# EAGLE design mainboard (EAGLE 5.10)
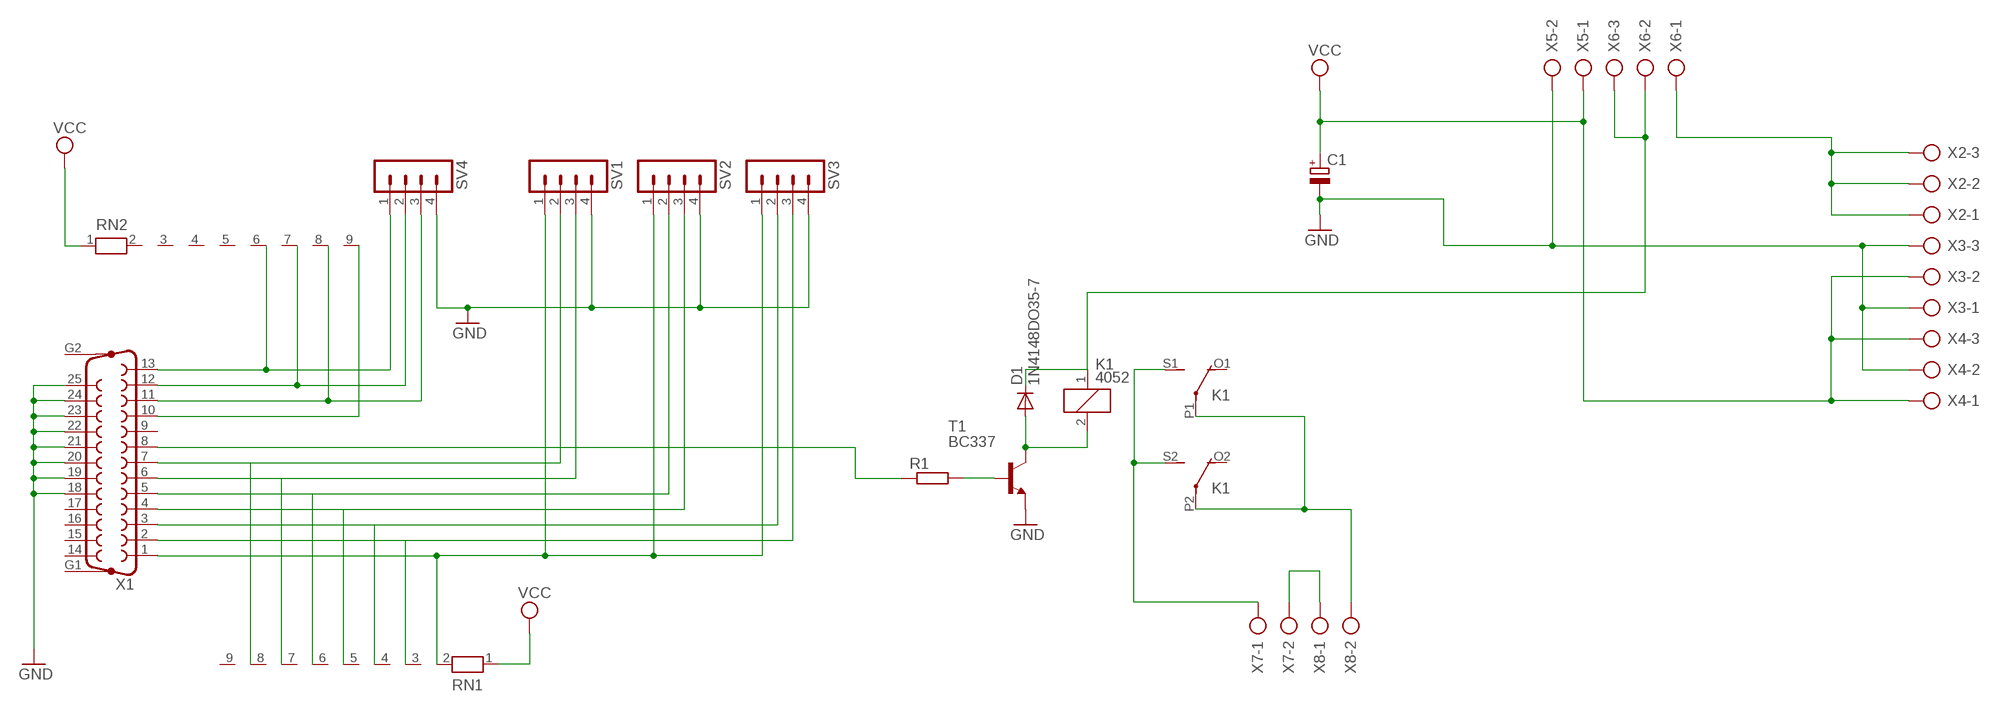
[diagram p0: schematic, sheet 1]

## Parts
C1  CPOL-EUE5-10.5  [E5-10,5]
D1  1N4148DO35-7  [DO35-7]
K1  4052  [F4052]
R1  R-EU_0207/15  [0207/15]
RN1  RN08  [RN-9]
RN2  RN08  [RN-9]
SV1  MA04-1  [MA04-1]
SV2  MA04-1  [MA04-1]
SV3  MA04-1  [MA04-1]
SV4  MA04-1  [MA04-1]
T1  BC337  [TO92]
X1  F25HP  [F25HP]
X2  AK500/3-H  [AK500/3-H]
X3  AK500/3-H  [AK500/3-H]
X4  AK500/3-H  [AK500/3-H]
X5  AK500/2-H  [AK500/2-H]
X6  AK500/3-H  [AK500/3-H]
X7  AK500/2-H  [AK500/2-H]
X8  AK500/2-H  [AK500/2-H]

## Nets
N$1: RN1.3 SV3.3 X1.2
N$2: RN2.9 X1.10
N$3: RN2.8 SV4.3 X1.11
N$4: RN1.4 SV3.2 X1.3
N$5: RN2.7 SV4.2 X1.12
N$6: RN1.5 SV2.3 X1.4
N$8: RN1.6 SV2.2 X1.5
N$10: RN1.7 SV1.3 X1.6
N$11: RN1.8 SV1.2 X1.7
N$12: RN2.6 SV4.1 X1.13
N$15: D1.C K1.1 X6.2 X6.3
N$16: D1.A K1.2 T1.3(C)
N$17: R1.2 T1.2(B)
N$18: R1.1 X1.8
N$21: K1.S1(2:S) K1.S2(3:S) X7.1
N$23: X7.2 X8.1
N$24: K1.P1(2:P) K1.P2(3:P) X8.2
N$28: X2.1 X2.2 X2.3 X6.1
N$38: C1.+ RN1.1 RN2.1 X3.2 X4.1 X4.3 X5.1 ; supply symbol labelled VCC
N$39: C1.- SV1.4 SV2.4 SV3.4 SV4.4 T1.1(E) X1.18 X1.19 X1.20 X1.21 X1.22 X1.23 X1.24 X1.25 X3.1 X3.3 X4.2 X5.2 ; supply symbol labelled GND
N$41: RN1.2 SV1.1 SV2.1 SV3.1 X1.1
Unconnected: K1.O1(2:O) K1.O2(3:O) RN1.9 RN2.2 RN2.3 RN2.4 RN2.5 X1.9 X1.14 X1.15 X1.16 X1.17 X1.G1 X1.G2

## Library data of the parts
C1 = rcl:CPOL-EU: POLARIZED CAPACITOR, European symbol
D1 = diode:1N4148: DIODE high speed (Philips)
K1 = relay:4052: RELAY 2 x switch, Finder
R1 = resistor:R-EU_: RESISTOR, European symbol
RN1 RN2 = resistor-net:RN08: RESISTOR NETWORK
SV1-SV4 = con-lstb:MA04-1: PIN HEADER
T1 = transistor:BC337: NPN TRANSISTOR
X1 = con-subd:F25HP: SUB-D
X2-X4 X6 = con-ptr500:AK500/3-H: CONNECTOR Aug. 2004 / PTR Meßtechnik: Die Bezeichnung der Serie AK505 wurde geändert. Es handelt sich hierbei um AK500 in horizontaler Ausführung.
X5 X7 X8 = con-ptr500:AK500/2-H: CONNECTOR Aug. 2004 / PTR Meßtechnik: Die Bezeichnung der Serie AK505 wurde geändert. Es handelt sich hierbei um AK500 in horizontaler Ausführung.

## Board
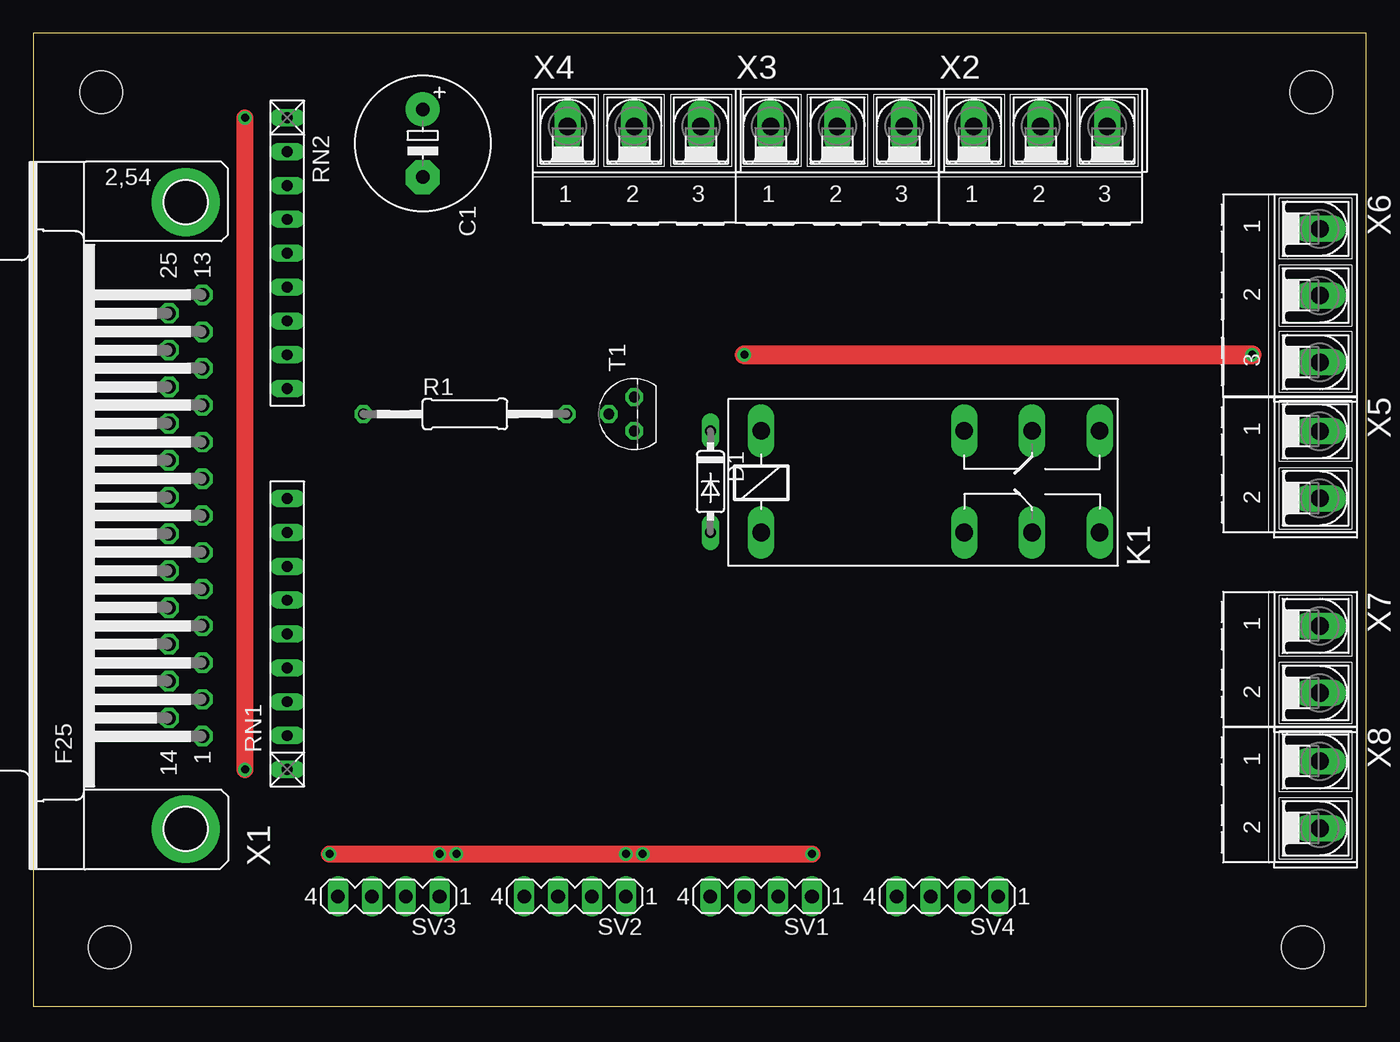
[diagram p1: board, top side]
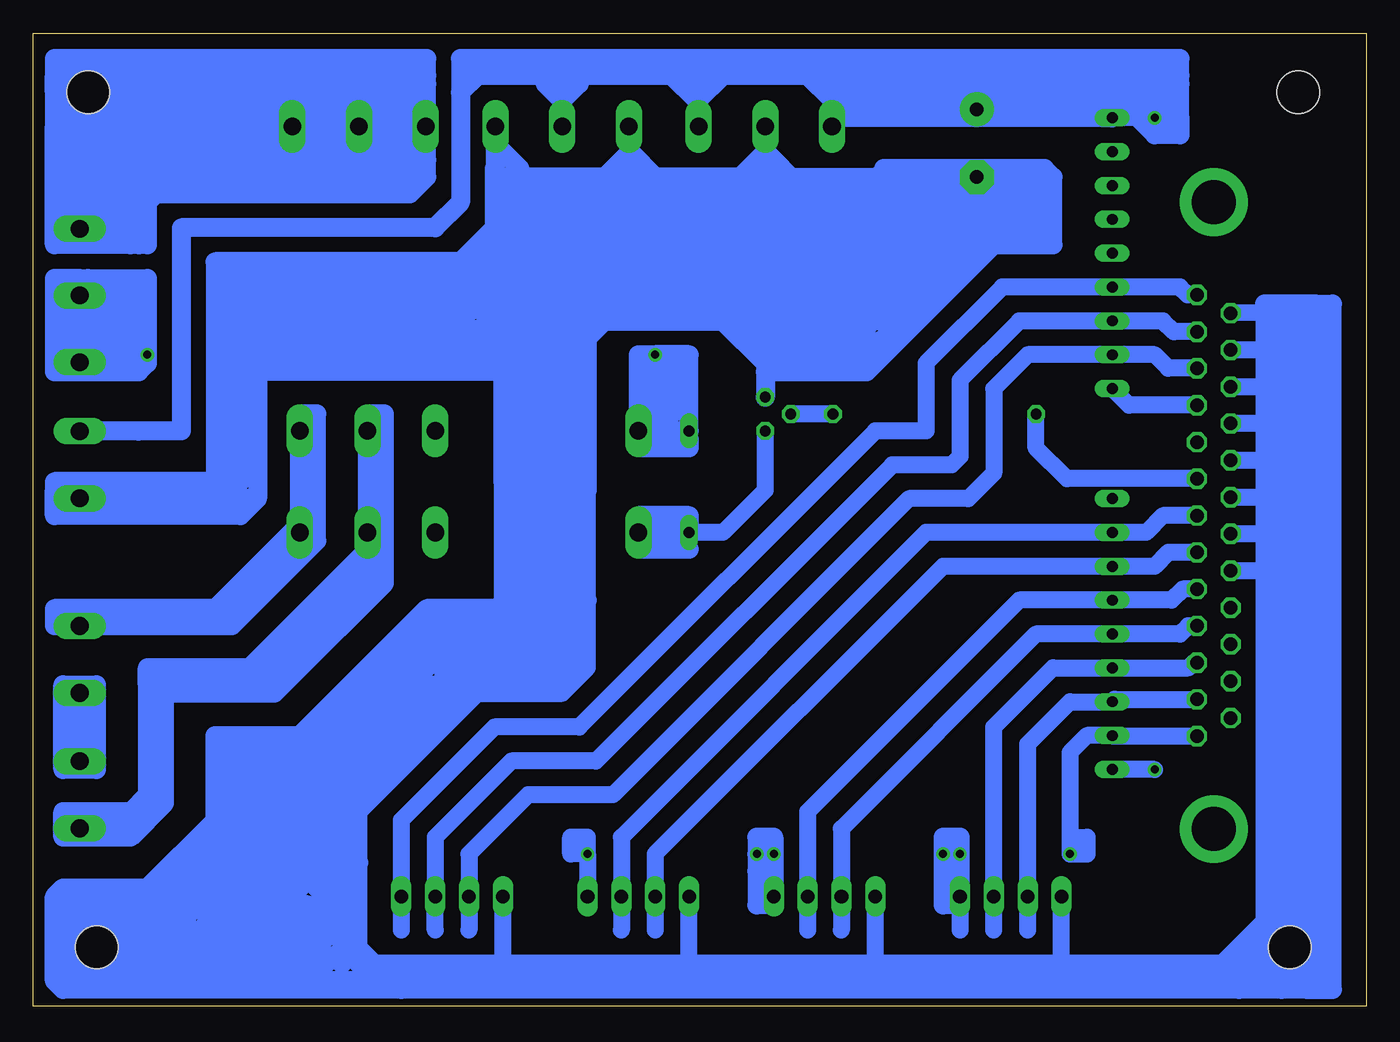
[diagram p2: board, bottom side, seen from below]

Size 100 x 73.02 mm. Coordinates in mm from the lower left corner, seen from the top.
Outline: 0,0 100,0 100,73.02 0,73.02 0,0
Copper layers (1*16): Top 0.035mm / dielectric 1.5mm / Bottom 0.035mm
Design rules "default": minimum track width 10mil, minimum drill 24mil, track to track 8mil, track to pad 8mil, pad to pad 8mil, via to via 8mil, smd to smd 8mil, copper to edge 40mil, drill to drill 8mil, minimum pad ring 10mil, minimum via ring 8mil, stop-mask expansion 4mil, vias tented up to drill 0mil, thermal gap 10mil
Holes 3.2 mm at 5.08,68.58 5.71,4.45 95.25,4.45 95.89,68.58

### Footprints (pad centres in the part's own frame; a part is rotated, then mirrored left to right if it is on the bottom)
E5-10,5 = drill 1.016 pad 2.54 round: + -2.54,0 | drill 1.016 pad 2.54 octagon: - 2.54,0
DO35-7 = drill 0.813 long: A 3.81,0; C -3.81,0
F4052 = drill 1.321 long: 1 -3.81,3.81; 2 -3.81,-3.81; O1 11.43,-3.81; O2 11.43,3.81; P1 16.51,-3.81; P2 16.51,3.81; S1 21.59,-3.81; S2 21.59,3.81
0207/15 = drill 0.813 octagon: 1 -7.62,0; 2 7.62,0
RN-9 = drill 0.813 long: 1 -10.16,0; 2 -7.62,0; 3 -5.08,0; 4 -2.54,0; 5 0,0; 6 2.54,0; 7 5.08,0; 8 7.62,0; 9 10.16,0
MA04-1 = drill 1.016 long: 1 -3.81,0; 2 -1.27,0; 3 1.27,0; 4 3.81,0
TO92 = drill 0.813 octagon: 1 1.27,0; 2 0,1.905; 3 -1.27,0
F25HP = drill 1.016 octagon: 1 -16.561,-1.27; 2 -13.792,-1.27; 3 -11.049,-1.27; 4 -8.28,-1.27; 5 -5.512,-1.27; 6 -2.769,-1.27; 7 0,-1.27; 8 2.769,-1.27; 9 5.512,-1.27; 10 8.28,-1.27; 11 11.049,-1.27; 12 13.792,-1.27; 13 16.561,-1.27; 14 -15.189,1.27; 15 -12.421,1.27; 16 -9.652,1.27; 17 -6.909,1.27; 18 -4.14,1.27; 19 -1.372,1.27; 20 1.372,1.27; 21 4.14,1.27; 22 6.909,1.27; 23 9.652,1.27; 24 12.421,1.27; 25 15.189,1.27 | drill 3.302 pad 5.08 round: G1 -23.52,0; G2 23.52,0
AK500/3-H = drill 1.321 long: 1 -5.004,0; 2 0,0; 3 5.004,0
AK500/2-H = drill 1.321 long: 1 -2.515,0; 2 2.515,0

### Placement (x,y rotation side)
C1  29.21,64.77 270 top
D1  50.8,39.37 270 top
K1  58.42,39.37 0 top
R1  32.38,44.45 0 top
RN1  19.05,27.94 90 top
RN2  19.05,56.52 270 top
SV1  54.61,8.26 180 top
SV2  40.64,8.26 180 top
SV3  26.67,8.26 180 top
SV4  68.58,8.26 180 top
T1  45.09,44.45 90 top
X1  11.43,36.83 90 top
X2  75.56,66.04 0 top
X3  60.33,66.04 0 top
X4  45.09,66.04 0 top
X5  96.52,40.64 270 top
X6  96.52,53.34 270 top
X7  96.52,26.04 270 top
X8  96.52,15.88 270 top

### Tracks (layer width: path | path; a pad name or v marks a point on that pad's centre or on a via)
N$1
  Bottom 1.27: X1.2 18.87,23.04 RN1.3 22.23,22.86 25.4,19.68 SV3.3 25.4,5.71
N$2
  Bottom 1.27: X1.10 17.8,45.11 RN2.9
N$3
  Bottom 1.27: X1.11 14.86,47.88 15.88,48.9 RN2.8 25.4,48.9 27.94,46.35 27.94,40.01 29.84,38.1 34.29,38.1 56.52,15.88 62.87,15.88 67.31,11.43 SV4.3 67.31,5.71
N$4
  Bottom 1.27: X1.3 12.95,25.78 13.34,25.4 RN1.4 23.5,25.4 27.94,20.95 SV3.2 27.94,5.71
N$5
  Bottom 1.27: X1.12 14.43,50.62 15.24,51.44 RN2.7 26.04,51.44 30.48,46.99 30.48,41.27 31.11,40.64 35.56,40.64 57.78,18.41 64.14,18.41 69.85,12.7 SV4.2
N$6
  Bottom 1.27: X1.4 13.36,28.55 13.97,27.94 RN1.5 24.77,27.94 39.37,13.34 SV2.3 39.37,5.71
N$7
  Bottom 1.27: 69.85,5.71 69.85,7.62
N$8
  Bottom 1.27: X1.5 13.77,31.32 14.61,30.48 RN1.6 26.04,30.48 41.91,14.61 SV2.2 41.91,5.71
N$10
  Bottom 1.27: X1.6 14.83,34.06 15.88,33.02 RN1.7 31.75,33.02 53.34,11.43 SV1.3 53.34,5.71
N$11
  Bottom 1.27: X1.7 15.24,36.83 16.51,35.56 RN1.8 33.02,35.56 55.88,12.7 SV1.2 55.88,5.71
N$12
  Bottom 1.27: X1.13 13.39,53.39 13.97,53.98 RN2.6 | 72.39,5.71 SV4.1 72.39,13.97 65.41,20.95 59.05,20.95 36.83,43.18 33.02,43.18 33.02,48.26 27.3,53.98 RN2.6 | RN2.6 19.68,53.98
N$15  (via drill 0.6)
  Top 1.422: v53.34,48.9 v91.44,48.9
  Bottom 1.422: 53.98,43.18 D1.C 50.8,48.9 52.7,48.9 | 53.98,43.18 K1.1 54.61,48.9 v53.34,48.9 52.7,48.9 | X6.3 93.9,48.34 93.34,48.26 | 95.89,54.61 96.52,53.98 X6.2 X6.3 | v91.44,48.9 92.08,48.26 93.34,48.26 | X6.3 96.52,48.26 97.16,47.62 97.16,47.7 X6.3 | 96.52,54.61 95.89,54.61 | 96.52,54.61 98.42,54.61 98.42,47.62 92.08,47.62 91.44,48.26 91.44,54.61 95.89,54.61 | 96.52,54.61 97.79,53.34 97.79,48.26 93.34,48.26 | 93.34,48.26 92.08,49.53 92.08,53.98 95.89,53.98 95.89,50.8 95.25,50.16 | 95.25,50.16 95.25,49.53 94.61,49.53 | 94.61,49.53 93.34,49.53 93.34,53.34 94.61,53.34 94.61,49.53 | 94.61,49.53 94.61,48.9 | 95.25,50.16 94.61,49.53 | 52.7,48.9 52.7,43.81 52.07,44.45 52.07,48.26 53.34,48.26 53.98,47.62 53.98,43.18
  other vias: 50.8,43.18
N$16
  Bottom 1.27: K1.2 D1.A 48.26,35.56 45.09,38.73 T1.3
N$17
  Bottom 1.27: R1.2 T1.2
N$18
  Bottom 1.27: X1.8 22.45,39.6 24.77,41.91 R1.1
N$20
  Bottom 1.422: 24.13,57.78 65.41,57.78 65.41,62.87
N$21
  Bottom 1.422: 80.01,44.45 78.74,44.45 78.74,34.92 85.09,28.57 98.42,28.57 98.42,29.84 86.36,29.84 80.01,36.2 | K1.S1 80.01,36.2 | K1.S1 80.64,34.92 80.01,34.29 | 80.01,36.2 K1.S2 | K1.S1 80.01,34.92 | X7.1 87.02,28.55 K1.S1 | 80.01,34.29 K1.S1 | 80.01,34.29 85.72,28.57
N$23
  Bottom 1.422: 96.52,23.5 X7.2 | 96.52,23.5 X8.1 | 96.52,23.5 97.79,23.5 97.79,18.41 95.25,18.41 | 95.25,18.41 95.25,22.86 | 95.25,22.86 95.89,23.5 95.25,23.5 | 95.25,22.86 95.25,24.13 97.79,24.13 97.79,17.78 95.25,17.78 95.25,18.41
N$24
  Bottom 1.422: X8.2 93.32,13.36 91.44,15.24 91.44,15.88 | 91.44,24.13 91.44,15.88 | 91.44,24.13 91.44,25.4 83.82,25.4 74.93,34.29 | K1.P2 K1.P1 74.93,34.29 | 74.93,34.29 74.93,31.11 81.92,24.13 | 81.92,24.13 82.55,24.13 | 83.19,24.13 90.17,24.13 | 90.17,24.13 91.44,24.13 | 83.19,24.13 83.19,24.77 | 83.19,24.77 75.56,32.38 | 74.93,44.45 73.66,44.45 73.66,31.75 80.64,24.77 81.28,24.13 | 82.55,24.13 83.19,24.13 | 81.28,24.13 81.92,24.13 | 82.55,24.13 83.19,24.77 | 90.17,24.13 90.17,15.24 92.71,12.7 97.79,12.7 97.79,14.61 92.71,14.61 91.44,15.88 | 90.81,23.5 81.92,23.5 81.28,24.13
N$26
  Bottom 1.422: 92.71,57.15 92.71,58.42 92.08,59.05
N$27
  Bottom 1.422: 54.61,36.2 50.8,36.2 50.8,36.83 54.61,36.83
N$28
  Bottom 1.422: 92.08,58.42 97.16,58.42 | 92.08,59.69 92.08,58.42 | 92.08,59.69 92.08,60.96 90.81,60.96 | 90.81,60.96 71.75,60.96 70.48,62.23 70.48,63.5 | 70.48,64.77 70.48,66.04 | X2.2 X2.1 70.48,66.04 | X2.2 X2.3 | X2.2 97.16,66.04 | 97.16,66.04 98.42,66.04 | 98.42,59.69 98.42,66.04 | 98.42,59.69 98.42,57.15 92.08,57.15 | 92.08,57.15 92.08,58.42 | 92.08,59.69 93.34,59.69 | 93.34,59.69 93.98,59.69 | 93.98,59.69 95.25,59.69 | 95.25,59.69 98.42,59.69 | X6.1 96.52,65.41 97.16,66.04 | 95.25,59.69 95.25,65.41 | 93.98,62.23 93.98,59.69 | 93.98,64.77 93.98,62.23 | 93.98,64.77 93.98,65.41 | 70.48,64.77 93.98,64.77 | 70.48,63.5 70.48,64.77 | 70.48,63.5 93.34,63.5 93.34,62.87 93.98,62.23 | 93.98,62.23 92.08,62.23 | 92.08,62.23 71.12,62.23 | 92.08,62.23 93.34,60.96 | 93.34,59.69 93.34,61.59 | 70.48,66.04 70.48,69.22 | 70.48,69.85 70.48,71.12 98.42,71.12 98.42,69.85 | 98.42,68.58 98.42,69.22 | 98.42,68.58 98.42,67.31 | 98.42,67.31 98.42,66.04 | 98.42,67.31 71.12,67.31 71.12,68.58 | 71.12,68.58 71.12,69.22 98.42,69.22 | 98.42,69.22 98.42,69.85 | 98.42,69.85 97.79,70.48 71.12,70.48 70.48,69.85 | 70.48,69.22 70.48,69.85 | 70.48,69.22 71.12,68.58 | 71.12,68.58 96.52,68.58 | 96.52,68.58 98.42,68.58 | 96.52,68.58 95.89,67.94 | 90.81,60.96 91.44,60.33 | 91.44,60.33 92.08,59.69 | 92.08,57.15 91.44,57.15 91.44,60.33
N$29
  Bottom 1.422: 97.79,58.42 97.79,65.41
N$30
  Bottom 1.422: 50.8,34.29 54.61,34.29
N$32
  Bottom 1.422: 54.61,41.91 50.8,41.91 50.8,42.55 54.61,42.55
N$33
  Bottom 1.422: 59.05,38.1 59.05,25.4 60.33,24.13 60.33,38.73 | 60.33,38.73 59.05,38.73 | 60.96,38.73 64.14,38.73 64.14,37.47 | 60.33,38.73 60.96,38.73 | 60.96,38.73 61.59,38.1 61.59,24.77 62.23,24.13 62.87,24.13 62.87,38.1 | 62.87,38.1 62.87,39.37 | 62.87,38.1 63.5,37.47 63.5,24.77 64.14,24.13 60.96,24.13
N$34
  Bottom 1.422: 64.77,24.13 64.77,28.57 64.14,29.21
N$37
  Bottom 1.422: 78.11,8.26 78.11,9.53 | 78.11,6.99 78.11,5.08 80.64,2.54 93.98,2.54 96.52,5.08 95.25,5.08 93.98,6.35 | 93.98,6.35 95.89,6.35 | 93.98,6.35 88.9,6.35 85.72,9.53 79.38,9.53 78.11,8.26 | 78.11,6.99 78.11,8.26 | 78.11,6.99 81.92,3.17 93.34,3.17 94.61,4.45 82.55,4.45 79.38,7.62 80.01,7.62 80.64,8.26 | 80.64,8.26 80.01,8.89 | 95.25,5.71 83.19,5.71 80.64,8.26 | 80.64,8.26 85.09,8.26 87,6.35 85.09,6.35 83.82,7.62 83.82,6.35 82.55,7.62
N$38  (via drill 0.6)
  Top 1.27: v15.88,17.78 v15.88,66.67
  Bottom 1.27: v15.88,17.78 RN1.1 | v15.88,66.67 17.14,66.67 RN2.1
  Bottom 1.422: 66.67,69.85 67.31,69.85 | 52.07,69.85 66.67,69.85 | 48.26,69.85 52.07,69.85 | 41.91,69.85 48.26,69.85 | 22.23,69.85 41.91,69.85 | 15.88,69.85 20.32,69.85 | 15.88,69.85 13.97,69.85 | 13.97,69.85 13.97,71.12 34.92,71.12 | X4.1 40.08,71.04 40.01,71.12 | 50.16,71.12 50.16,67.94 | 50.16,67.94 50.16,66.12 X4.3 | 60.33,71.12 60.33,67.94 | 60.33,67.94 X3.2 | 50.16,71.12 60.33,71.12 | X5.1 92.1,43.16 88.9,43.18 88.9,58.42 69.85,58.42 67.94,60.33 67.94,68.58 | 67.94,68.58 67.94,71.12 60.33,71.12 | 34.92,71.12 40.01,71.12 | 34.92,71.12 34.29,70.48 C1.+ 19.68,70.48 19.05,69.85 19.05,68.58 | RN2.1 19.05,68.58 | 40.01,71.12 50.16,71.12 | v15.88,66.67 15.88,69.85 | v15.88,66.67 15.88,67.94 17.14,69.22 17.14,68.58 18.41,67.31 18.41,68.58 17.78,69.22 17.78,67.94 17.14,67.31 16.51,67.31 v15.88,66.67 | v15.88,66.67 13.97,66.67 | 13.97,66.67 13.97,69.22 | 13.97,69.22 15.24,69.22 15.24,68.58 14.61,67.94 14.61,67.31 | 13.97,69.22 13.97,69.85 | RN2.1 22.23,69.85 | 20.32,69.85 22.23,69.85 | 20.32,69.85 19.05,68.58 | RN2.1 40.01,66.67 40.01,67.94 | 40.01,67.94 20.95,67.94 22.23,69.22 39.37,69.22 | 40.01,67.94 41.91,69.85 | 48.26,69.85 50.16,67.94 | 52.07,69.85 50.16,67.94 | 60.33,67.94 59.05,69.22 | 60.33,67.94 61.59,69.22 | 66.67,69.85 67.94,68.58 | 13.97,66.67 13.97,65.41 15.88,65.41 17.14,66.67
N$39
  Bottom 1.27: 22.86,3.17 SV3.4 | 22.86,3.17 36.83,3.17 | 36.83,3.17 SV2.4 | 50.8,3.17 SV1.4 | 36.83,3.17 50.8,3.17 | 64.77,3.17 SV4.4 | 64.77,3.17 50.8,3.17 | X1.25 5.71,52.07 5.71,49.53 | 5.71,33.02 5.71,35.56 | 5.71,35.56 5.71,38.1 | 5.71,38.1 5.71,41.27 | 5.71,41.27 5.71,43.81 | 5.71,43.81 5.71,46.99 | 5.71,46.99 5.71,49.53 | X1.18 6.04,32.69 5.71,33.02 | X1.19 5.82,35.46 5.71,35.56 | X1.20 5.82,38.2 5.71,38.1 | X1.21 6.02,40.97 5.71,41.27 | X1.22 5.79,43.74 5.71,43.81 | X1.23 6.22,46.48 5.71,46.99 | X1.24 5.99,49.25 5.71,49.53 | 5.71,3.17 5.71,33.02 | 5.71,3.17 9.53,3.17 | 11.43,3.17 22.86,3.17 | 64.77,3.17 72.39,3.17 73.03,3.17 73.03,2.54 | 73.03,2.54 73.03,1.27 72.39,1.27 | 9.53,1.27 5.71,1.27 5.71,1.91 5.71,3.17 | 60.96,40.01 59.69,39.37 58.42,38.73 58.42,30.48 58.42,25.4 60.33,23.5 66.67,23.5 75.56,14.61 75.56,10.79 75.56,4.45 73.66,2.54 73.03,2.54 | 6.99,3.81 6.99,6.35 6.99,52.07 | 5.71,2.54 11.43,2.54 73.03,2.54
  Bottom 1.422: 46.99,62.23 36.83,62.23 | 53.34,62.23 53.98,62.23 | 57.15,62.23 53.98,62.23 | 57.15,62.23 65.41,62.23 | 36.2,61.59 36.2,62.87 34.92,62.87 | 83.19,38.1 85.72,38.1 | 83.19,38.1 83.19,48.26 83.82,48.26 84.45,47.62 | 86.36,39.37 98.42,39.37 98.42,38.73 98.42,38.1 98.42,36.83 84.45,36.83 83.19,38.1 | 86.36,39.37 85.72,39.37 | 86.36,39.37 86.36,55.88 67.94,55.88 64.77,59.05 | 45.09,60.96 45.09,64.14 | 45.09,64.14 X4.2 | 45.09,60.96 55.24,60.96 | 55.24,60.96 55.24,64.14 | 55.24,64.14 55.24,65.96 X3.1 | 65.33,61.59 65.33,61.52 64.77,60.96 55.24,60.96 | 65.33,61.59 X3.3 | X5.2 85.7,38.12 85.72,40.01 85.72,47.62 84.45,47.62 | 64.77,47.62 84.45,47.62 | 64.77,59.05 64.77,59.69 | 64.77,59.69 64.77,61.04 65.33,61.59 | 64.77,47.62 64.77,55.24 | 64.77,55.24 64.77,57.78 | 64.77,57.78 64.77,59.05 | 64.77,57.78 66.04,56.52 | 66.04,56.52 67.94,54.61 85.72,54.61 85.72,48.9 65.41,48.9 65.41,51.44 | 65.41,51.44 65.41,53.34 | 65.41,53.34 65.41,53.98 | 65.41,54.61 65.41,55.88 67.94,53.34 85.09,53.34 85.09,51.44 | 85.09,50.8 85.09,49.53 66.67,49.53 66.04,50.16 66.04,50.8 | 66.04,51.44 66.04,50.8 | 66.04,51.44 66.04,53.34 66.67,53.98 66.67,52.7 67.31,52.07 84.45,52.07 85.09,51.44 | 85.09,50.8 85.09,51.44 | 66.04,50.8 85.09,50.8 | 84.45,47.62 84.45,39.37 85.09,38.73 | C1.- 29.21,60.96 45.09,60.96 | 64.77,39.37 60.96,40.01 60.96,51.44 | 64.77,39.37 64.77,47.62 | 86.36,16.51 86.36,13.97 91.44,8.89 97.79,8.89 98.42,8.26 98.42,1.91 97.79,1.27 72.39,1.27 9.53,1.27 | 86.36,16.51 86.36,19.05 | 86.36,19.05 86.36,20.32 80.01,20.32 | 80.01,20.32 70.48,29.84 59.05,29.84 58.42,30.48 | 64.77,39.37 64.77,30.48 | 23.5,62.23 23.5,57.15 27.94,57.15 33.02,52.07
  Bottom 1.422: 58.42,52.07 65.41,52.07 66.04,51.44 | 58.42,52.07 56.52,52.07 | 56.52,52.07 46.99,52.07 | 46.99,52.07 45.09,52.07 | 45.09,52.07 33.02,52.07 | 45.09,52.07 45.09,50.16 | 45.09,50.16 45.09,48.9 | 45.09,47.62 T1.1 | 33.02,52.07 37.47,47.62 45.09,47.62 | 45.09,48.26 45.09,47.62 | 45.09,48.26 45.09,48.9 | 45.09,48.9 37.47,48.9 34.92,51.44 44.45,51.44 44.45,50.16 38.1,50.16 37.47,50.8 | 46.99,52.07 45.09,50.16 | 63.5,51.44 65.41,51.44 | 62.23,51.44 63.5,51.44 | 60.96,51.44 62.23,51.44 | 59.69,51.44 60.96,51.44 | 59.69,51.44 48.26,51.44 45.09,48.26 | 65.41,53.34 33.02,53.34 29.21,57.15 30.48,57.15 31.11,56.52 | 31.11,56.52 33.66,53.98 65.41,53.98 | 65.41,54.61 65.41,53.98 | 64.77,55.24 65.41,54.61 | 64.77,55.24 33.02,55.24 | 66.04,56.52 31.11,56.52 | 64.77,59.05 24.13,59.05 | 64.77,59.69 24.77,59.69 24.13,60.33 | 58.42,50.16 58.42,52.07 | 59.69,39.37 59.69,51.44 | 62.23,51.44 62.23,41.27 61.59,40.64 62.23,40.01 62.23,50.16 63.5,51.44 | 63.5,51.44 63.5,40.01 | 58.42,38.73 58.42,50.16 | 58.42,50.16 56.52,52.07 | C1.- 29.84,62.87 | 23.5,62.23 C1.- | 23.5,62.23 24.13,62.87 29.84,62.87 | 29.84,62.87 34.92,62.87 | 34.92,62.87 35.56,62.23 C1.- | C1.- 24.77,62.23 24.13,61.59 26.04,61.59 | 26.04,61.59 31.11,61.59 | 26.04,61.59 24.77,60.33 29.84,60.33 | 68.58,24.13 71.12,24.13 72.39,22.86 69.85,22.86 69.85,21.59 74.3,21.59 | 64.14,28.57 70.48,28.57 78.74,20.32 76.83,20.32 69.22,27.94 65.41,27.94 65.41,24.13 66.67,24.13 66.67,27.3 67.94,27.3 68.58,26.67 67.94,26.67 67.31,26.04 67.31,24.77 67.94,24.13 67.94,23.5 69.22,22.23 69.22,25.4 68.58,26.04 68.58,25.4 69.85,26.67 69.85,26.04 74.3,21.59 | 76.83,19.05 74.3,21.59 | 78.74,19.05 76.83,19.05
  Bottom 1.422: 78.74,19.05 80.01,20.32 | 74.3,21.59 74.3,20.95 71.12,20.95 70.48,20.32 74.93,20.32 75.56,19.68 72.39,19.68 71.75,19.05 72.39,19.05 | 76.83,19.05 72.39,19.05 | 86.36,19.05 78.74,19.05 | 72.39,19.05 72.39,18.41 73.03,17.78 85.72,17.78 85.72,17.14 86.36,16.51 | 86.36,16.51 74.3,16.51 | 74.3,16.51 73.66,17.14 | 74.3,16.51 76.2,14.61 | 76.2,14.61 76.2,15.88 85.09,15.88 85.72,15.24 76.83,15.24 76.2,14.61 | 76.2,14.61 85.09,14.61 85.72,13.97 76.83,13.97 76.2,13.34 86.36,13.34 87.63,12.06 76.2,12.06 | 75.56,10.79 88.27,10.79 90.81,8.26 96.52,8.26 97.79,6.99 97.79,3.17 96.52,1.91 94.61,1.91 | 79.38,1.91 73.66,1.91 72.39,3.17 | 72.39,3.17 75.56,3.17 76.83,4.45 76.83,10.16 87,10.16 89.53,7.62 95.25,7.62 97.16,5.71 97.16,4.45 94.61,1.91 | 79.38,1.91 94.61,1.91 | 79.38,1.91 77.47,3.81 76.83,3.17 | 6.35,1.27 9.53,1.27 | 6.35,1.27 5.71,1.91 | 11.43,3.17 72.39,3.17 | 9.53,3.17 11.43,3.17 | 9.53,3.17 7.62,3.17 6.99,3.81 7.62,4.45 | 6.99,52.07 4.45,52.07 4.45,1.27 | 4.45,1.27 3.81,1.27 | 3.81,1.27 2.54,1.27 2.54,52.7 3.81,52.7 | 3.81,1.27 3.81,52.7 | 4.45,1.27 6.35,1.27 | 9.53,1.27 9.53,3.17 | 9.53,3.17 9.53,3.81 6.99,6.35 6.99,5.71 9.53,3.17 | 3.81,52.7 7.62,52.7 7.62,6.35 11.43,2.54 11.43,3.17 | 55.24,64.14 57.15,62.23 | 55.24,64.14 53.34,62.23 | 53.34,62.23 53.34,61.59 53.98,62.23 | 53.98,62.23 54.61,62.87 | 46.99,62.23 53.34,62.23 | 45.09,64.14 46.99,62.23 | 45.09,64.14 42.55,61.59
N$40
  Bottom 1.422: 63.5,62.87 65.41,64.77
N$41  (via drill 0.6)
  Top 1.27: v22.23,11.43 v30.48,11.43 v31.75,11.43 v44.45,11.43 v45.72,11.43 v58.42,11.43
  Bottom 1.27: X1.1 19,20.27 RN1.2 20.95,20.32 22.23,19.05 22.23,12.7 | v30.48,11.43 30.48,10.16 SV3.1 30.48,7.62 30.48,5.71 | 22.23,12.7 v22.23,11.43 20.95,11.43 20.95,12.7 22.23,12.7 | v58.42,11.43 SV1.1 | v44.45,11.43 44.45,10.16 SV2.1 | v58.42,11.43 59.69,11.43 59.69,12.7 58.42,12.7 v58.42,11.43 | v44.45,11.43 v45.72,11.43 45.72,12.7 | v44.45,11.43 44.45,12.7 | v30.48,11.43 30.48,12.7 | 31.75,12.7 v31.75,11.43 v30.48,11.43
  Bottom 1.422: v31.75,11.43 31.75,10.16 30.48,10.16 | v45.72,11.43 45.72,10.16 44.45,10.16 | 44.45,7.62 45.72,7.62 45.72,12.7 44.45,12.7 44.45,7.62 | 30.48,12.7 31.75,12.7 31.75,7.62 30.48,7.62 30.48,12.7